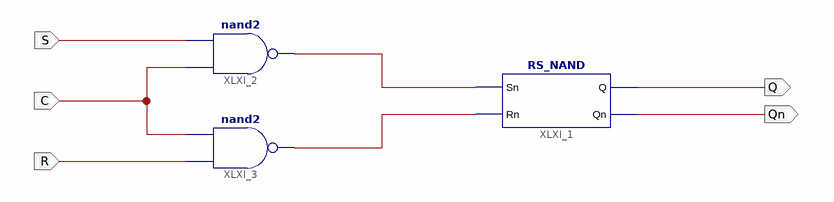
[diagram p0: schematic sheet 1]
// Xilinx ISE schematic RS_EN.sch (kintex7) as structural Verilog: 3 symbols, 5 ports
module RS_EN (
  input  C,
  input  R,
  input  S,
  output Q,
  output Qn
);

  wire XLXN_1, XLXN_2;

  RS_NAND XLXI_1 (.Sn(XLXN_1), .Rn(XLXN_2), .Q(Q), .Qn(Qn));
  nand XLXI_3 (XLXN_2, R, C);
  nand XLXI_2 (XLXN_1, C, S);
endmodule
